# EAGLE design projeto 1.5 (EAGLE 7.5.0)
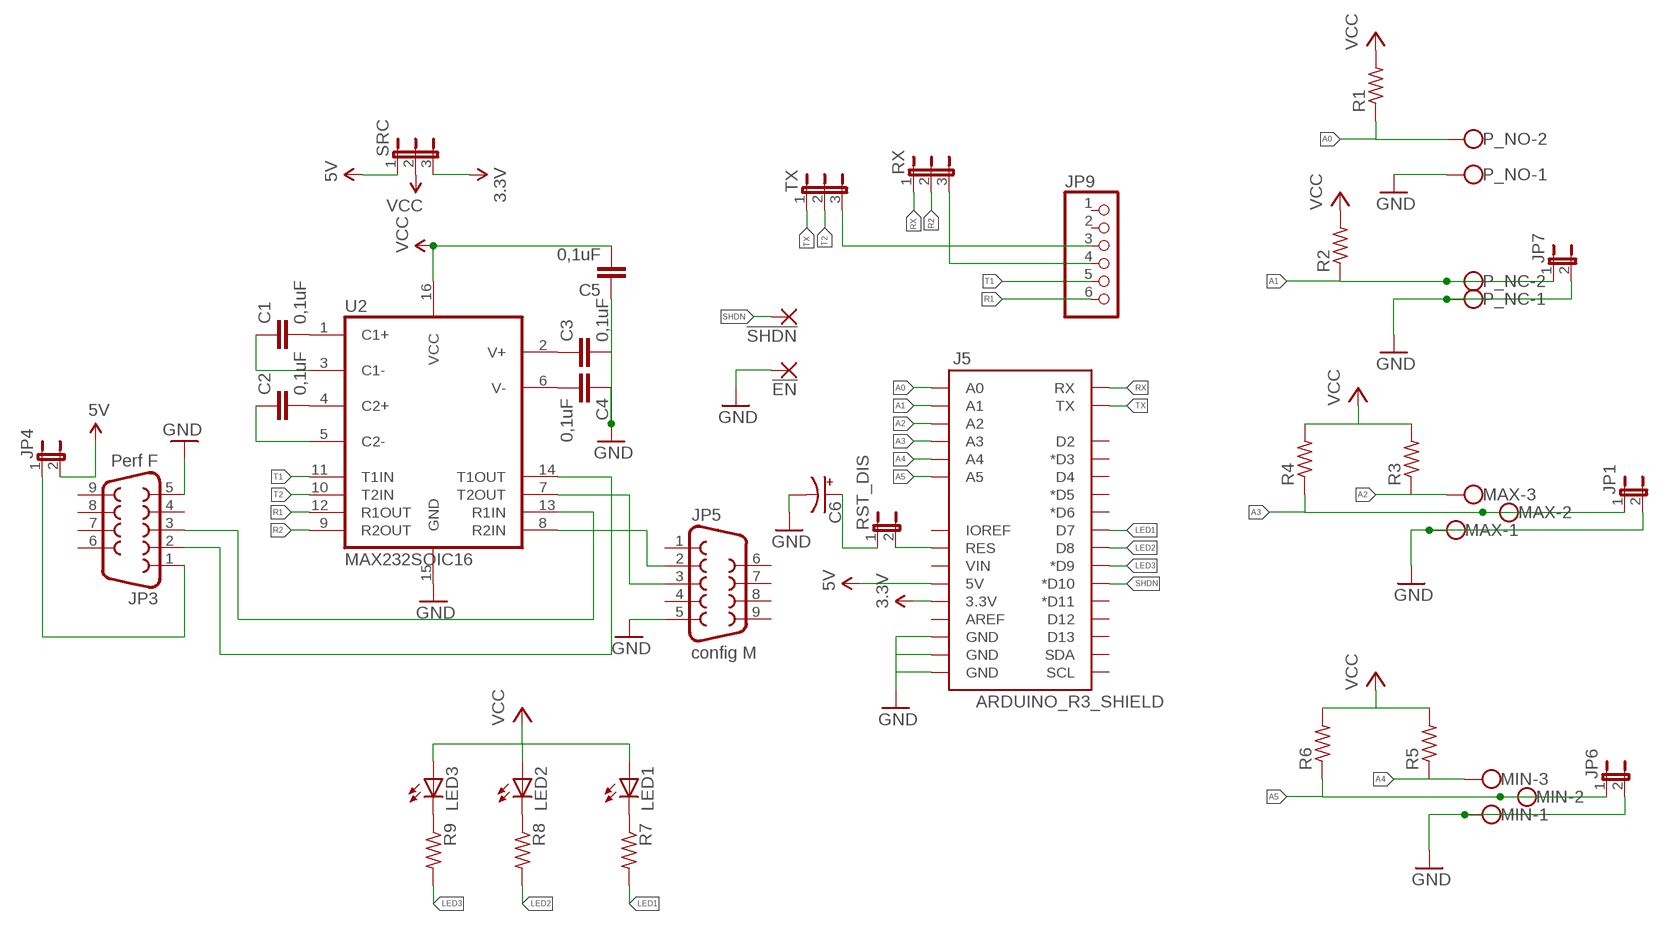
[diagram p0: schematic, sheet 1]

## Parts
!EN  SMD2  [SMD1,27-2,54]
!SHDN  SMD2  [SMD1,27-2,54]
C1  0,1uF  C-EUC0805K  [C0805K]
C2  0,1uF  C-EUC0805K  [C0805K]
C3  0,1uF  C-EUC0805K  [C0805K]
C4  0,1uF  C-EUC0805K  [C0805K]
C5  0,1uF  C-EUC0805K  [C0805K]
C6  CPOL-USTT5D10  [TT5D10]
J5  ARDUINO_R3_SHIELD  [UNO_R3_SHIELD]
JP1  JP1E  [JP1]
JP3  Perf F  DB9FEMALE  [DB9]
JP4  JP1E  [JP1]
JP5  config M  DB9MALE  [DB9_MALE]
JP6  JP1E  [JP1]
JP7  JP1E  [JP1]
JP9  PINHD-1X6  [1X06]
LED1  LED3MM  [LED3MM]
LED2  LED3MM  [LED3MM]
LED3  LED3MM  [LED3MM]
MAX  W237-103  [W237-103]
MIN  W237-103  [W237-103]
P_NC  W237-102  [W237-102]
P_NO  W237-102  [W237-102]
R1  R-US_R0805  [R0805]
R2  R-US_R0805  [R0805]
R3  R-US_R0805  [R0805]
R4  R-US_R0805  [R0805]
R5  R-US_R0805  [R0805]
R6  R-US_R0805  [R0805]
R7  R-US_R0805  [R0805]
R8  R-US_R0805  [R0805]
R9  R-US_R0805  [R0805]
RST_DIS  JP1E  [JP1]
RX  JP2W  [JP2W]
SRC  JP2W  [JP2W]
TX  JP2W  [JP2W]
U2  MAX232SOIC16  [SO016]

## Nets
3.3V: J5.3.3V SRC.3
5V: J5.5V JP4.2 SRC.1
A0: J5.A0 P_NO.2 R1.1
A1: J5.A1 JP7.1 P_NC.2 R2.1
A2: J5.A2 MAX.3 R3.1
A3: J5.A3 JP1.1 MAX.2 R4.1
A4: J5.A4 MIN.3 R5.1
A5: J5.A5 JP6.1 MIN.2 R6.1
GND: !EN.1(P) C3.2 C4.1 C5.1 C6.- J5.GND@0(GND) J5.GND@1(GND) J5.GND@2(GND) JP1.2 JP3.5 JP5.5 JP6.2 JP7.2 MAX.1 MIN.1 P_NC.1 P_NO.1 U2.15(GND)
LED1: J5.D7 R7.2
LED2: J5.D8 R8.2
LED3: J5.D9(*D9) R9.2
N$1: LED1.K(C) R7.1
N$2: C1.2 U2.1(C1+)
N$3: JP9.4 RX.3
N$4: C2.2 U2.4(C2+)
N$5: C1.1 U2.3(C1-)
N$6: LED2.K(C) R8.1
N$7: C2.1 U2.5(C2-)
N$8: JP9.3 TX.3
N$9: J5.RES RST_DIS.2
N$10: C6.+ RST_DIS.1
N$11: JP5.3 U2.7(T2OUT)
N$12: LED3.K(C) R9.1
N$13: C3.1 U2.2(V+)
N$14: JP5.2 U2.8(R2IN)
N$15: JP3.3 U2.13(R1IN)
N$16: JP3.1 JP4.1
N$19: JP3.2 U2.14(T1OUT)
N$23: C4.2 U2.6(V-)
R1: JP9.6 U2.12(R1OUT)
R2: RX.2 U2.9(R2OUT)
RX: J5.RX RX.1
SHDN: !SHDN.1(P) J5.D10(*D10)
T1: JP9.5 U2.11(T1IN)
T2: TX.2 U2.10(T2IN)
TX: J5.TX TX.1
VCC: C5.2 LED1.A LED2.A LED3.A R1.2 R2.2 R3.2 R4.2 R5.2 R6.2 SRC.2 U2.16(VCC)
Unconnected: J5.AREF J5.D2 J5.D3(*D3) J5.D4 J5.D5(*D5) J5.D6(*D6) J5.D11(*D11) J5.D12 J5.D13 J5.IOREF J5.SCL J5.SDA J5.VIN JP3.4 JP3.6 JP3.7 JP3.8 JP3.9 JP5.1 JP5.4 JP5.6 JP5.7 JP5.8 JP5.9 JP9.1 JP9.2

## Library data of the parts
!EN !SHDN = wirepad:SMD2: SMD PAD
C1-C5 = resistor:C-EU: CAPACITOR, European symbol
C6 = rcl:CPOL-US: POLARIZED CAPACITOR, American symbol
J5 = SparkFun-Boards:ARDUINO_R3_SHIELD: Shield form compatible with the Arduino Uno R3.
JP1 JP4 JP6 JP7 RST_DIS = jumper:JP1E: JUMPER
JP3 = SparkFun-Connectors:DB9: DB9 Connector Standard DB9 (D-Sub 9) serial connector. Can be used for CAN bus as well as RS485 and RS232. Footprint production proven. Spark Fun Electronics SKU : PRT-00429; PROD_ID: CONN-08194
JP5 = SparkFun-Connectors:DB9: DB9 Connector Standard DB9 (D-Sub 9) serial connector. Can be used for CAN bus as well as RS485 and RS232. Footprint production proven. Spark Fun Electronics SKU : PRT-00429; PROD_ID: CONN-09904
JP9 = pinhead:PINHD-1X6: PIN HEADER
LED1-LED3 = led:LED: LED OSRAM: - CHIPLED LG R971, LG N971, LY N971, LG Q971, LY Q971, LO R971, LY R971 LH N974, LH R974 LS Q976, LO Q976, LY Q976 LO Q996 - Hyper CHIPLED LW Q18S LB Q993, LB Q99A, LB R99A - SideLED LS A670, LO A670, LY A670, LG A670, LP A670 LB A673, LV A673, LT A673, LW A673 LH A674 LY A675 LS A676, LA A676, LO A676, LY A676, LW A676 LS A679, LY A679, LG A679 - Hyper Micro SIDELED® LS Y876, LA Y876, LO Y876, LY Y876 LT Y87S - SmartLED LW L88C, LW L88S LB L89C, LB L89S, LG L890 LS L89K, LO L89K, LY L89K LS L896, LA L896, LO L896, LY L896 - TOPLED LS T670, LO T670, LY T670, LG T670, LP T670 LSG T670, LSP T670, LSY T670, LOP T670, LYG T670 LG T671, LOG T671, LSG T671 LB T673, LV T673, LT T673, LW T673 LH T674 LS T676, LA T676, LO T676, LY T676, LB T676, LH T676, LSB T676, LW T676 LB T67C, LV T67C, LT T67C, LS T67K, LO T67K, LY T67K, LW E67C LS E67B, LA E67B, LO E67B, LY E67B, LB E67C, LV E67C, LT E67C LW T67C LS T679, LY T679, LG T679 LS T770, LO T770, LY T770, LG T770, LP T770 LB T773, LV T773, LT T773, LW T773 LH T774 LS E675, LA E675, LY E675, LS T675 LS T776, LA T776, LO T776, LY T776, LB T776 LHGB T686 LT T68C, LB T68C - Hyper Mini TOPLED® LB M676 - Mini TOPLED Santana® LG M470 LS M47K, LO M47K, LY M47K Source: http://www.osram.convergy.de LUXEON: - LUMILED® LXK2-PW12-R00, LXK2-PW12-S00, LXK2-PW14-U00, LXK2-PW14-V00 LXK2-PM12-R00, LXK2-PM12-S00, LXK2-PM14-U00 LXK2-PE12-Q00, LXK2-PE12-R00, LXK2-PE12-S00, LXK2-PE14-T00, LXK2-PE14-U00 LXK2-PB12-K00, LXK2-PB12-L00, LXK2-PB12-M00, LXK2-PB14-N00, LXK2-PB14-P00, LXK2-PB14-Q00 LXK2-PR12-L00, LXK2-PR12-M00, LXK2-PR14-Q00, LXK2-PR14-R00 LXK2-PD12-Q00, LXK2-PD12-R00, LXK2-PD12-S00 LXK2-PH12-R00, LXK2-PH12-S00 LXK2-PL12-P00, LXK2-PL12-Q00, LXK2-PL12-R00 Source: www.luxeon.com KINGBRIGHT: KA-3528ASYC Source: www.kingbright.com
MAX MIN = con-wago-500:W237-103: WAGO SCREW CLAMP; MPN: 237-103; OC_FARNELL: unknown; OC_NEWARK: 18M7116
P_NC P_NO = con-wago-500:W237-102: WAGO SCREW CLAMP; MPN: 237-102; OC_FARNELL: unknown; OC_NEWARK: 70K9898
R1-R9 = resistor:R-US_: RESISTOR, American symbol
RX SRC TX = jumper:JP2W: JUMPER
U2 = SparkFun-DigitalIC:MAX232: RS232 Transceiver Very common IC. This is generically called 'MAX232', but works with the 3V equivalent MAX3232 generic ICs. Field tested and mother approved. Spark Fun Electronics SKU : COM-00316 (DIP) and COM-00589 (SMD); PROD_ID: IC-08171

## Board
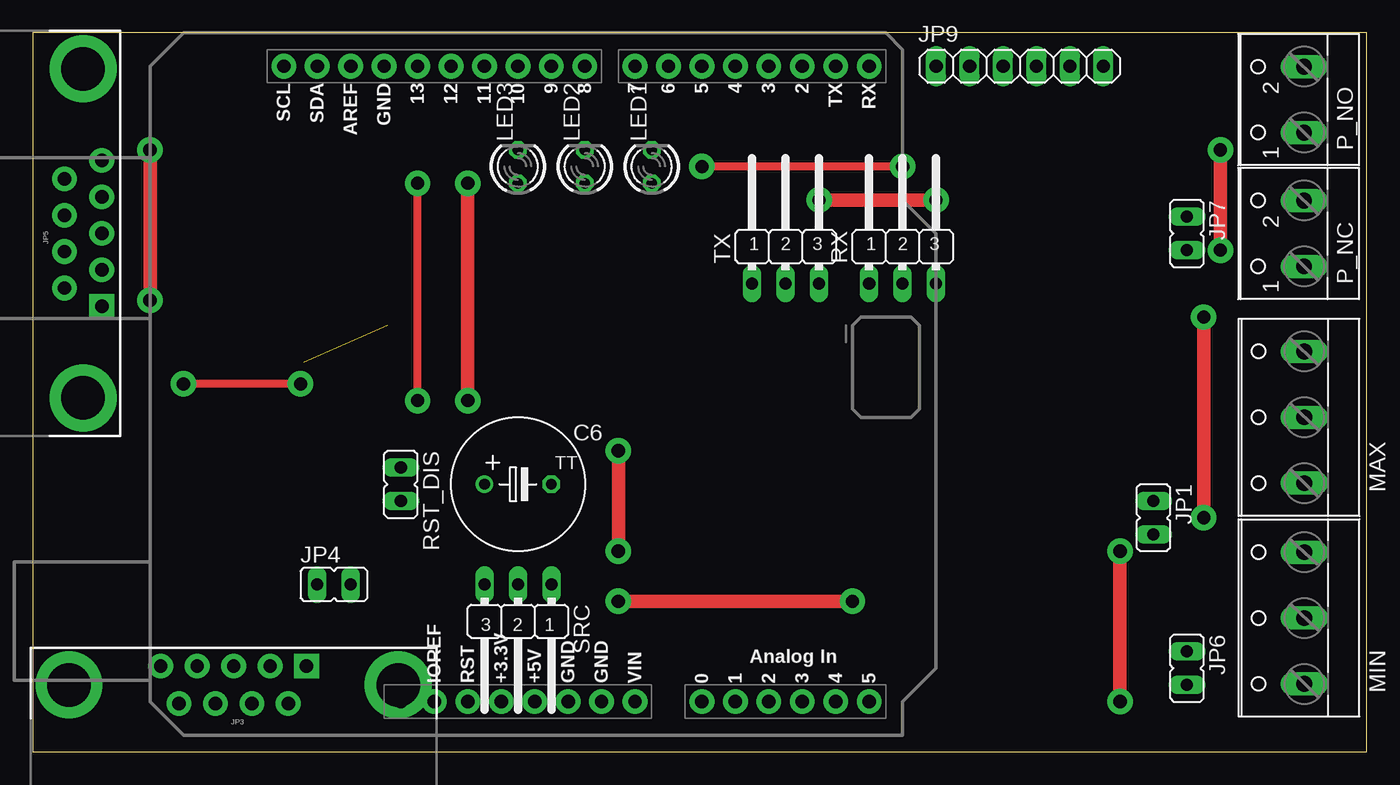
[diagram p1: board, top side]
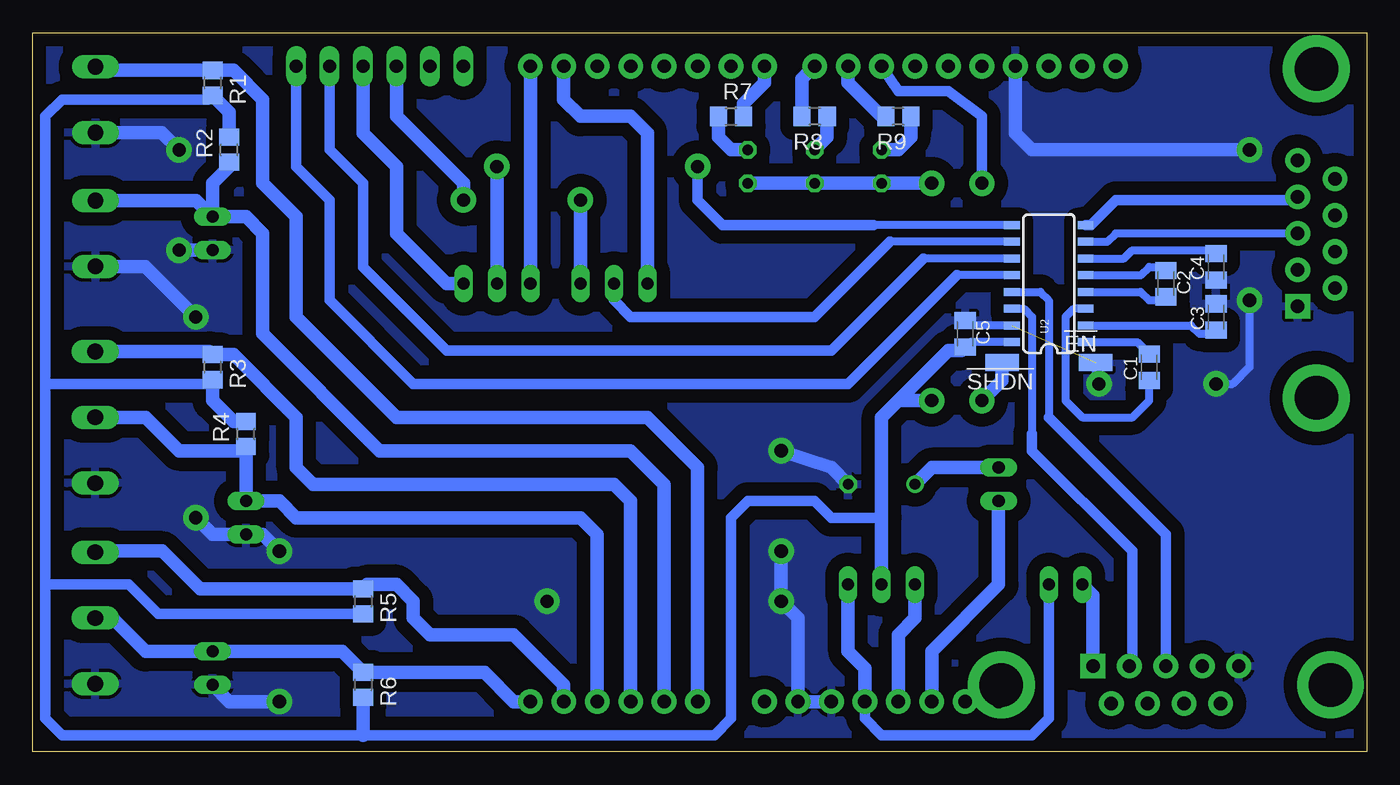
[diagram p2: board, bottom side, seen from below]

Size 101.27 x 54.6 mm. Coordinates in mm from the lower left corner, seen from the top.
Outline: 0,0 101.27,0 101.27,54.6 0,54.6 0,0
Copper layers (1*16): Top 0.035mm / dielectric 1.5mm / Bottom 0.035mm
Design rules "default": minimum track width 10mil, minimum drill 24mil, track to track 8mil, track to pad 8mil, pad to pad 8mil, via to via 8mil, smd to smd 8mil, copper to edge 40mil, drill to drill 8mil, minimum pad ring 10mil, minimum via ring 8mil, stop-mask expansion 4mil, vias tented up to drill 0mil, thermal gap 10mil

### Footprints (pad centres in the part's own frame; a part is rotated, then mirrored left to right if it is on the bottom)
SMD1,27-2,54 = smd 1.27 x 2.54: 1 0,0
C0805K = smd 1.3 x 1.6: 1 -1,0; 2 1,0
TT5D10 = drill 0.813: + -2.54,0 | drill 0.813 octagon: - 2.54,0
UNO_R3_SHIELD = drill 1.016 pad 1.88: 3.3V 50.8,26.67; 5V 50.8,29.21; A0 50.8,41.91; A1 50.8,44.45; A2 50.8,46.99; A3 50.8,49.53; A4 50.8,52.07; A5 50.8,54.61; AREF 2.54,15.24; D2 2.54,49.53; D3 2.54,46.99; D4 2.54,44.45; D5 2.54,41.91; D6 2.54,39.37; D7 2.54,36.83; D8 2.54,33.02; D9 2.54,30.48; D10 2.54,27.94; D11 2.54,25.4; D12 2.54,22.86; D13 2.54,20.32; GND@0 50.8,31.75; GND@1 50.8,34.29; GND@2 2.54,17.78; IOREF 50.8,21.59; NC 50.8,19.05; RES 50.8,24.13; RX 2.54,54.61; SCL 2.54,10.16; SDA 2.54,12.7; TX 2.54,52.07; VIN 50.8,36.83
JP1 = drill 0.914 long: 1 0,-1.27; 2 0,1.27
DB9 = drill 1.016 pad 1.88 square: 1 -5.54,-1.42 | drill 1.016 pad 1.88: 2 -2.77,-1.42; 3 0,-1.42; 4 2.77,-1.42; 5 5.54,-1.42; 6 -4.15,1.42; 7 -1.38,1.42; 8 1.38,1.42; 9 4.15,1.42 | drill 3.302 pad 5.08: G1 -12.5,0; G2 12.5,0
DB9_MALE = drill 1.016 pad 1.88: 1 5.54,-1.42; 2 2.77,-1.42; 3 0,-1.42; 4 -2.77,-1.42; 6 4.15,1.42; 7 1.38,1.42; 8 -1.38,1.42; 9 -4.15,1.42 | drill 1.016 pad 1.88 square: 5 -5.54,-1.42 | drill 3.302 pad 5.08: G1 -12.5,0; G2 12.5,0
1X06 = drill 1.016 long: 1 -6.35,0; 2 -3.81,0; 3 -1.27,0; 4 1.27,0; 5 3.81,0; 6 6.35,0
LED3MM = drill 0.813 octagon: A -1.27,0; K 1.27,0
W237-103 = drill 1.194 long: 1 -5,-1.29; 2 0,-1.29; 3 5,-1.29
W237-102 = drill 1.194 long: 1 -2.5,-1.27; 2 2.5,-1.27
R0805 = smd 1.3 x 1.5: 1 -0.95,0; 2 0.95,0
JP2W = drill 0.914 long: 1 -2.54,-1.27; 2 0,-1.27; 3 2.54,-1.27
SO016 = smd 0.6 x 1.2: 1 -4.445,-2.8; 2 -3.175,-2.8; 3 -1.905,-2.8; 4 -0.635,-2.8; 5 0.635,-2.8; 6 1.905,-2.8; 7 3.175,-2.8; 8 4.445,-2.8; 9 4.445,2.8; 10 3.175,2.8; 11 1.905,2.8; 12 0.635,2.8; 13 -0.635,2.8; 14 -1.905,2.8; 15 -3.175,2.8; 16 -4.445,2.8

### Placement (x,y rotation side)
!EN  20.57,29.57 270 bottom
!SHDN  27.69,29.57 90 bottom
C1  16.51,29.21 90 bottom
C2  15.24,35.56 270 bottom
C3  11.43,33.02 90 bottom
C4  11.43,36.83 90 bottom
C5  30.48,31.75 270 bottom
C6  36.83,20.32 0 top
J5  8.89,54.61 270 top
JP1  85.09,17.78 180 top
JP3  15.24,5.08 180 top
JP4  22.86,12.7 270 top
JP5  3.81,39.37 90 top
JP6  87.63,6.35 180 top
JP7  87.63,39.37 180 top
JP9  74.93,52.07 0 top
LED1  46.99,44.45 90 top
LED2  41.91,44.45 90 top
LED3  36.83,44.45 90 top
MAX  95.25,25.4 90 top
MIN  95.25,10.16 90 top
P_NC  95.25,39.37 90 top
P_NO  95.25,49.53 90 top
R1  87.63,50.8 270 bottom
R2  86.36,45.72 90 bottom
R3  87.63,29.21 270 bottom
R4  85.09,24.13 90 bottom
R5  76.2,11.43 270 bottom
R6  76.2,5.08 270 bottom
R7  48.26,48.26 0 bottom
R8  41.91,48.26 180 bottom
R9  35.56,48.26 180 bottom
RST_DIS  27.94,20.32 180 top
RX  66.04,36.83 0 top
SRC  36.83,11.43 180 top
TX  57.15,36.83 0 top
U2  24.13,35.56 90 bottom

### Tracks (layer width: path | path; a pad name or v marks a point on that pad's centre or on a via)
3.3V
  Bottom 1.016: J5.3.3V 35.56,8.89 34.29,10.16 SRC.3
5V
  Bottom 0.813: JP4.2 24.13,2.54 25.4,1.27 36.83,1.27 38.1,2.54 J5.5V
  Bottom 1.016: J5.5V 38.1,6.35 39.37,7.62 SRC.1
A0
  Bottom 1.016: J5.A0 50.8,21.59 54.61,25.4 73.66,25.4 81.28,33.02 81.28,40.64 83.82,43.18 83.82,49.53 86.04,51.75 R1.1 96.24,51.75 P_NO.2
A1
  Bottom 1.016: J5.A1 53.34,20.32 55.88,22.86 74.93,22.86 83.82,31.75 83.82,39.37 85.09,40.64 JP7.1 | P_NC.2 88.86,41.87 JP7.1 | R2.1 86.36,44.45 87.63,43.18 JP7.1
A2
  Bottom 1.016: J5.A2 55.88,19.05 57.15,20.32 80.01,20.32 81.28,21.59 81.28,25.4 86.04,30.16 R3.1 87.87,30.4 MAX.3
A3
  Bottom 1.016: J5.A3 58.42,16.51 59.69,17.78 81.28,17.78 82.55,19.05 JP1.1 R4.1 85.41,22.86 90.17,22.86 92.71,25.4 MAX.2
A4
  Bottom 1.016: MIN.3 96.46,15.24 91.44,15.24 88.58,12.38 R5.1 75.88,12.7 73.66,12.7 72.39,11.43 72.39,10.16 71.12,8.89 64.77,8.89 60.96,5.08 J5.A4
A5
  Bottom 1.016: J5.A5 64.77,3.81 66.99,6.03 R6.1 77.79,7.62 JP6.1 92.71,7.62 95.25,10.16 MIN.2
GND  (via drill 1 pad 1.93)  (1 unrouted)
  Top 0.61: v20.32,27.94 v11.43,27.94
  Top 1.016: v8.89,34.29 v8.89,45.72 | v44.45,11.43 v62.23,11.43 | v82.55,15.24 v82.55,3.81 | v88.9,33.02 v88.9,17.78 | v90.17,45.72 v90.17,38.1 | v44.45,15.24 v44.45,22.86
  Bottom 0.61: U2.15 30.11,32.38 C5.1 | v11.43,27.94 10.16,27.94 8.89,29.21 v8.89,34.29 | !EN.1 20.57,28.19 v20.32,27.94
  Bottom 1.016: J5.GND@0 J5.GND@1 43.18,10.16 v44.45,11.43 v44.45,15.24 | v82.55,15.24 83.82,16.51 JP1.2 87.63,16.51 v88.9,17.78 | v82.55,3.81 86.36,3.81 JP6.2 | P_NC.1 92.75,36.87 v88.9,33.02 | v90.17,38.1 JP7.2 | P_NO.1 91.48,47.03 v90.17,45.72 | v44.45,22.86 40.64,21.59 C6.- | v8.89,45.72 25.4,45.72 26.67,46.99 J5.GND@2
  pour Bottom (isolate 1.016): 0,0 0,54.61 101.6,54.61 101.6,0
LED1
  Bottom 1.016: J5.D7 45.72,50.8 47.31,49.21 R7.2
LED2
  Bottom 1.016: R8.2 42.86,51.12 J5.D8
LED3
  Bottom 1.016: J5.D9 39.37,50.8 36.83,48.26 R9.2
N$1
  Bottom 1.016: R7.1 49.21,46.67 48.26,45.72 LED1.K
N$2
  Bottom 0.61: U2.1 17.41,31.11 C1.2
N$3
  Bottom 1.016: RX.3 69.85,35.56 73.66,39.37 73.66,44.45 76.2,46.99 JP9.4
N$4
  Bottom 0.61: U2.4 17.14,34.93 16.51,34.29 15.51,34.29 C2.2
N$5
  Bottom 0.61: U2.3 22.23,33.66 22.86,33.02 22.86,26.67 21.59,25.4 17.78,25.4 16.51,26.67 C1.1
N$6
  Bottom 1.016: R8.1 40.96,46.67 LED2.K
N$7
  Bottom 0.61: U2.5 17.14,36.2 16.51,36.83 15.51,36.83 C2.1
N$8  (via drill 1 pad 1.93)
  Top 1.016: v59.69,41.91 v68.58,41.91
  Bottom 1.016: TX.3 v59.69,41.91 | JP9.3 73.66,48.26 68.58,43.18 v68.58,41.91
N$9
  Bottom 1.016: J5.RES 33.02,7.62 27.94,12.7 RST_DIS.2
N$10
  Bottom 1.016: RST_DIS.1 33.02,21.59 C6.+
N$11
  Bottom 0.61: U2.7 19.68,38.74 19.05,39.37 JP5.3
N$12
  Bottom 1.016: LED3.K 35.56,45.72 34.61,46.67 R9.1
N$13
  Bottom 0.61: U2.2 13.34,32.38 12.7,31.75 11.7,31.75 C3.1
N$14
  Bottom 0.813: JP5.2 5.46,41.91 19.05,41.91 20.95,40.01 U2.8
N$15
  Bottom 0.61: U2.13 24.77,34.93 24.13,34.29 24.13,25.4
  Bottom 0.813: JP3.3 15.24,16.51 24.13,25.4
N$16
  Bottom 1.016: JP3.1 20.78,11.89 JP4.1
N$19
  Bottom 0.61: U2.14 26.04,33.66 25.4,33.02 25.4,24.13
  Bottom 0.813: 25.4,24.13 25.4,22.86 17.78,15.24 17.78,6.73 JP3.2
N$23
  Bottom 0.61: U2.6 18.41,37.47 17.78,38.1 11.7,38.1 C4.2
R1
  Bottom 0.61: U2.12 31.11,36.2
  Bottom 0.813: JP9.6 81.28,44.45 78.74,41.91 78.74,34.29 72.39,27.94 39.37,27.94 31.11,36.2
R2  (via drill 1 pad 1.93)
  Top 0.61: v66.04,44.45 v50.8,44.45
  Bottom 0.61: U2.9 37.47,40.01
  Bottom 0.813: 37.47,40.01 48.9,40.01 50.8,41.91 v50.8,44.45
  Bottom 1.016: RX.2 v66.04,44.45
RX
  Bottom 1.016: J5.RX RX.1
SHDN  (via drill 1 pad 1.93)
  Top 0.61: v29.21,26.67 v29.21,43.18
  Bottom 0.61: !SHDN.1 27.69,29.46
  Bottom 0.813: J5.D10 35.56,50.17 31.75,50.17 29.21,48.26 v29.21,43.18
  Bottom 1.016: 27.69,29.46 27.69,28.19 v29.21,26.67
T1
  Bottom 0.61: U2.11 33.66,37.47
  Bottom 0.813: 33.66,37.47 40.64,30.48 69.85,30.48 76.2,36.83 76.2,43.18 78.74,45.72 JP9.5
T2
  Bottom 0.61: U2.10 36.2,38.74
  Bottom 0.813: 36.2,38.74 41.91,33.02 55.88,33.02 57.15,34.29 TX.2
TX
  Bottom 1.016: TX.1 54.61,46.99 55.88,48.26 59.69,48.26 60.96,49.53 J5.TX
VCC  (via drill 1 pad 1.93)
  Top 1.016: v33.02,43.18 v33.02,26.67
  Bottom 0.61: U2.16 30.11,31.11 C5.2 | 87.95,27.94 R3.2 | 85.41,25.4 R4.2
  Bottom 0.813: 36.83,17.78 40.64,17.78 41.91,19.05 46.99,19.05 48.26,17.78 48.26,2.54 49.53,1.27 76.2,1.27 99.06,1.27 100.33,2.54 100.33,12.7 | 100.33,12.7 100.33,27.94 | 100.33,27.94 100.33,48.26 99.06,49.53 87.95,49.53 R1.2 | R5.2 91.76,10.48 93.98,12.7 100.33,12.7 | 87.63,27.94 100.33,27.94
  Bottom 1.016: SRC.2 36.83,17.78 36.83,25.4 35.56,26.67 | C5.2 30.75,30.48 31.75,30.48 35.56,26.67 | R2.2 86.36,48.58 R1.2 | LED1.A LED2.A LED3.A v33.02,43.18 | v33.02,26.67 35.56,26.67 | R3.2 87.63,27.94 87.63,26.67 86.04,25.08 R4.2 | R6.2 76.2,1.27